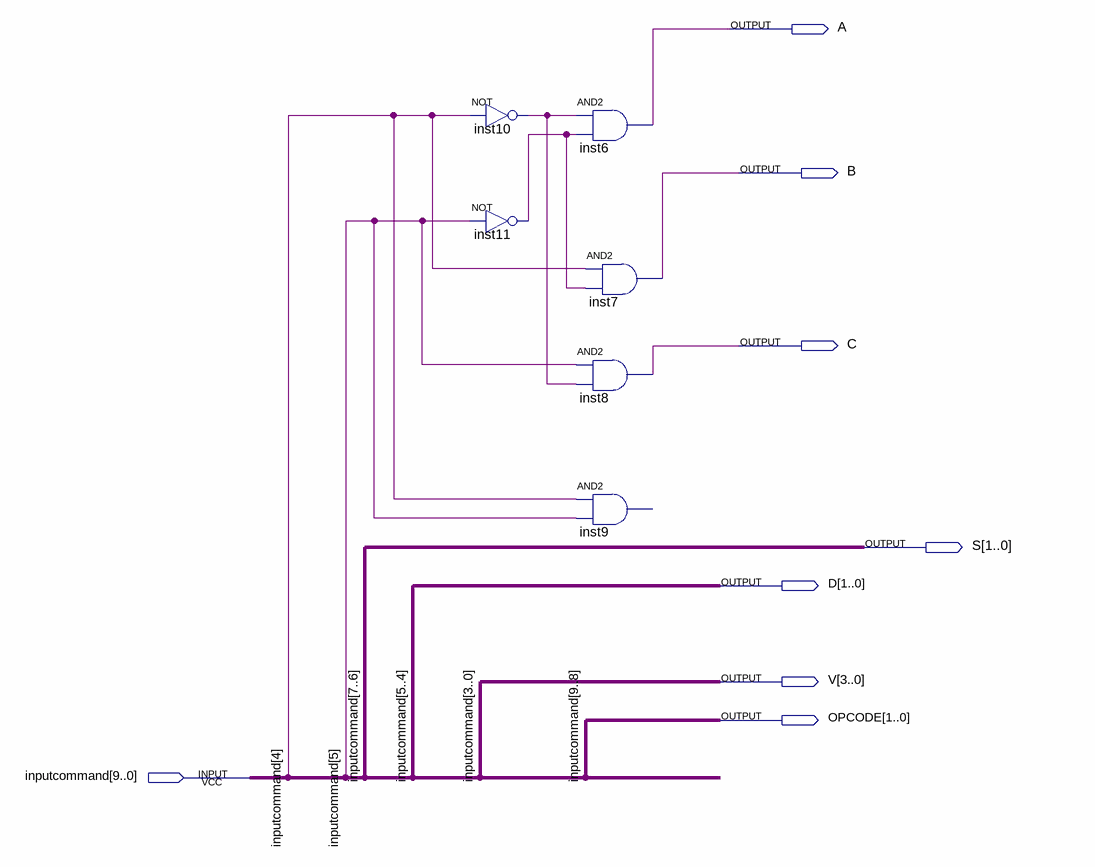
[diagram p0: schematic sheet]
// Quartus schematic decodingCircuiy.bdf as structural Verilog: 6 symbols, 8 pins
module decodingCircuiy (
  input  [9:0] inputcommand,
  output A,
  output B,
  output C,
  output [1:0] S,
  output [1:0] D,
  output [3:0] V,
  output [1:0] OPCODE
);

  wire inst10_out, inst11_out;

  not inst10 (inst10_out, inputcommand[4]);
  not inst11 (inst11_out, inputcommand[5]);
  and inst6 (A, inst10_out, inst11_out);
  and inst8 (C, inputcommand[5], inst10_out);
  // AND2 inst9 has open pins: IN1=inputcommand[4], IN2=inputcommand[5], OUT=open
  and inst7 (B, inputcommand[4], inst11_out);

  assign D = inputcommand[5:4];
  assign OPCODE = inputcommand[9:8];
  assign S = inputcommand[7:6];
  assign V = inputcommand[3:0];
endmodule
